# EAGLE schematic Test1 (EAGLE 9.3.0)
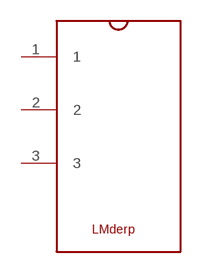
[diagram p0: schematic, sheet 1]

## Parts
U$1  TEST1THROUGH-HOLE  [TEST1]
Unconnected: U$1.1 U$1.2 U$1.3

## Library data of the parts
U$1 = Test1:TEST1